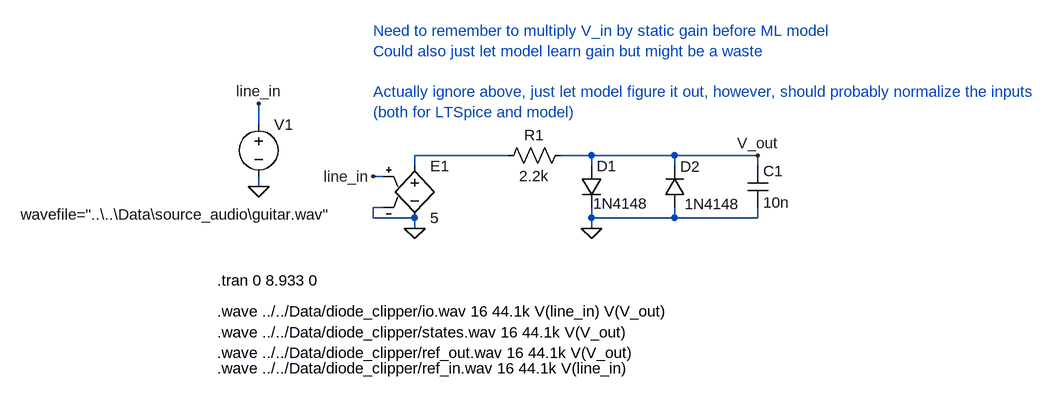
[diagram p0: schematic diode_clipper.asc]
diode_clipper.asc, the LTspice schematic file:
Version 4
SHEET 1 1164 680
WIRE -352 64 -352 32
WIRE 32 112 -112 112
WIRE 160 112 112 112
WIRE 288 112 160 112
WIRE 416 112 288 112
WIRE -112 128 -112 112
WIRE 160 128 160 112
WIRE 288 128 288 112
WIRE 416 128 416 112
WIRE -160 144 -176 144
WIRE -352 160 -352 144
WIRE -160 192 -176 192
WIRE -176 208 -176 192
WIRE -112 208 -176 208
WIRE 160 208 160 192
WIRE 288 208 288 192
WIRE 288 208 160 208
WIRE 416 208 416 192
WIRE 416 208 288 208
WIRE -112 224 -112 208
WIRE 160 224 160 208
FLAG 160 224 0
FLAG -352 160 0
FLAG -352 32 line_in
FLAG -112 224 0
FLAG -176 144 line_in
FLAG 416 112 V_out
SYMBOL res 128 96 R90
WINDOW 0 0 56 VBottom 2
WINDOW 3 32 56 VTop 2
SYMATTR InstName R1
SYMATTR Value 2.2k
SYMBOL diode 144 128 R0
WINDOW 3 19 58 Left 2
SYMATTR Value 1N4148
SYMATTR InstName D1
SYMBOL cap 400 128 R0
SYMATTR InstName C1
SYMATTR Value 10n
SYMBOL diode 304 192 R180
WINDOW 0 -23 63 Left 2
WINDOW 3 -84 5 Left 2
SYMATTR InstName D2
SYMATTR Value 1N4148
SYMBOL voltage -352 48 R0
WINDOW 3 -366 155 Left 2
WINDOW 123 0 0 Left 0
WINDOW 39 0 0 Left 0
SYMATTR Value wavefile="..\..\Data\source_audio\guitar.wav"
SYMATTR InstName V1
SYMBOL e -112 112 R0
SYMATTR InstName E1
SYMATTR Value 5
TEXT -416 304 Left 2 !.tran 0 8.933 0
TEXT -416 352 Left 2 !.wave ../../Data/diode_clipper/io.wav 16 44.1k V(line_in) V(V_out)
TEXT -176 -80 Left 2 ;Need to remember to multiply V_in by static gain before ML model\nCould also just let model learn gain but might be a waste\n \nActually ignore above, just let model figure it out, however, should probably normalize the inputs\n(both for LTSpice and model)
TEXT -416 384 Left 2 !.wave ../../Data/diode_clipper/states.wav 16 44.1k V(V_out)
TEXT -416 416 Left 2 !.wave ../../Data/diode_clipper/ref_out.wav 16 44.1k V(V_out)
TEXT -416 440 Left 2 !.wave ../../Data/diode_clipper/ref_in.wav 16 44.1k V(line_in)

The netlist it stands for:
* diode_clipper.asc
R1 V_out N001 2.2k
D1 V_out 0 1N4148
C1 V_out 0 10n
D2 0 V_out 1N4148
V1 line_in 0 wavefile="..\..\Data\source_audio\guitar.wav"
E1 N001 0 line_in 0 5
.model D D
.lib standard.dio
.tran 0 8.933 0
.wave ../../Data/diode_clipper/io.wav 16 44.1k V(line_in) V(V_out)
* Need to remember to multiply V_in by static gain before ML model
* Could also just let model learn gain but might be a waste
* Actually ignore above, just let model figure it out, however, should probably normalize the inputs
* (both for LTSpice and model)
.wave ../../Data/diode_clipper/states.wav 16 44.1k V(V_out)
.wave ../../Data/diode_clipper/ref_out.wav 16 44.1k V(V_out)
.wave ../../Data/diode_clipper/ref_in.wav 16 44.1k V(line_in)
.backanno
.end